# EAGLE schematic linkmp7 (EAGLE 5.05)
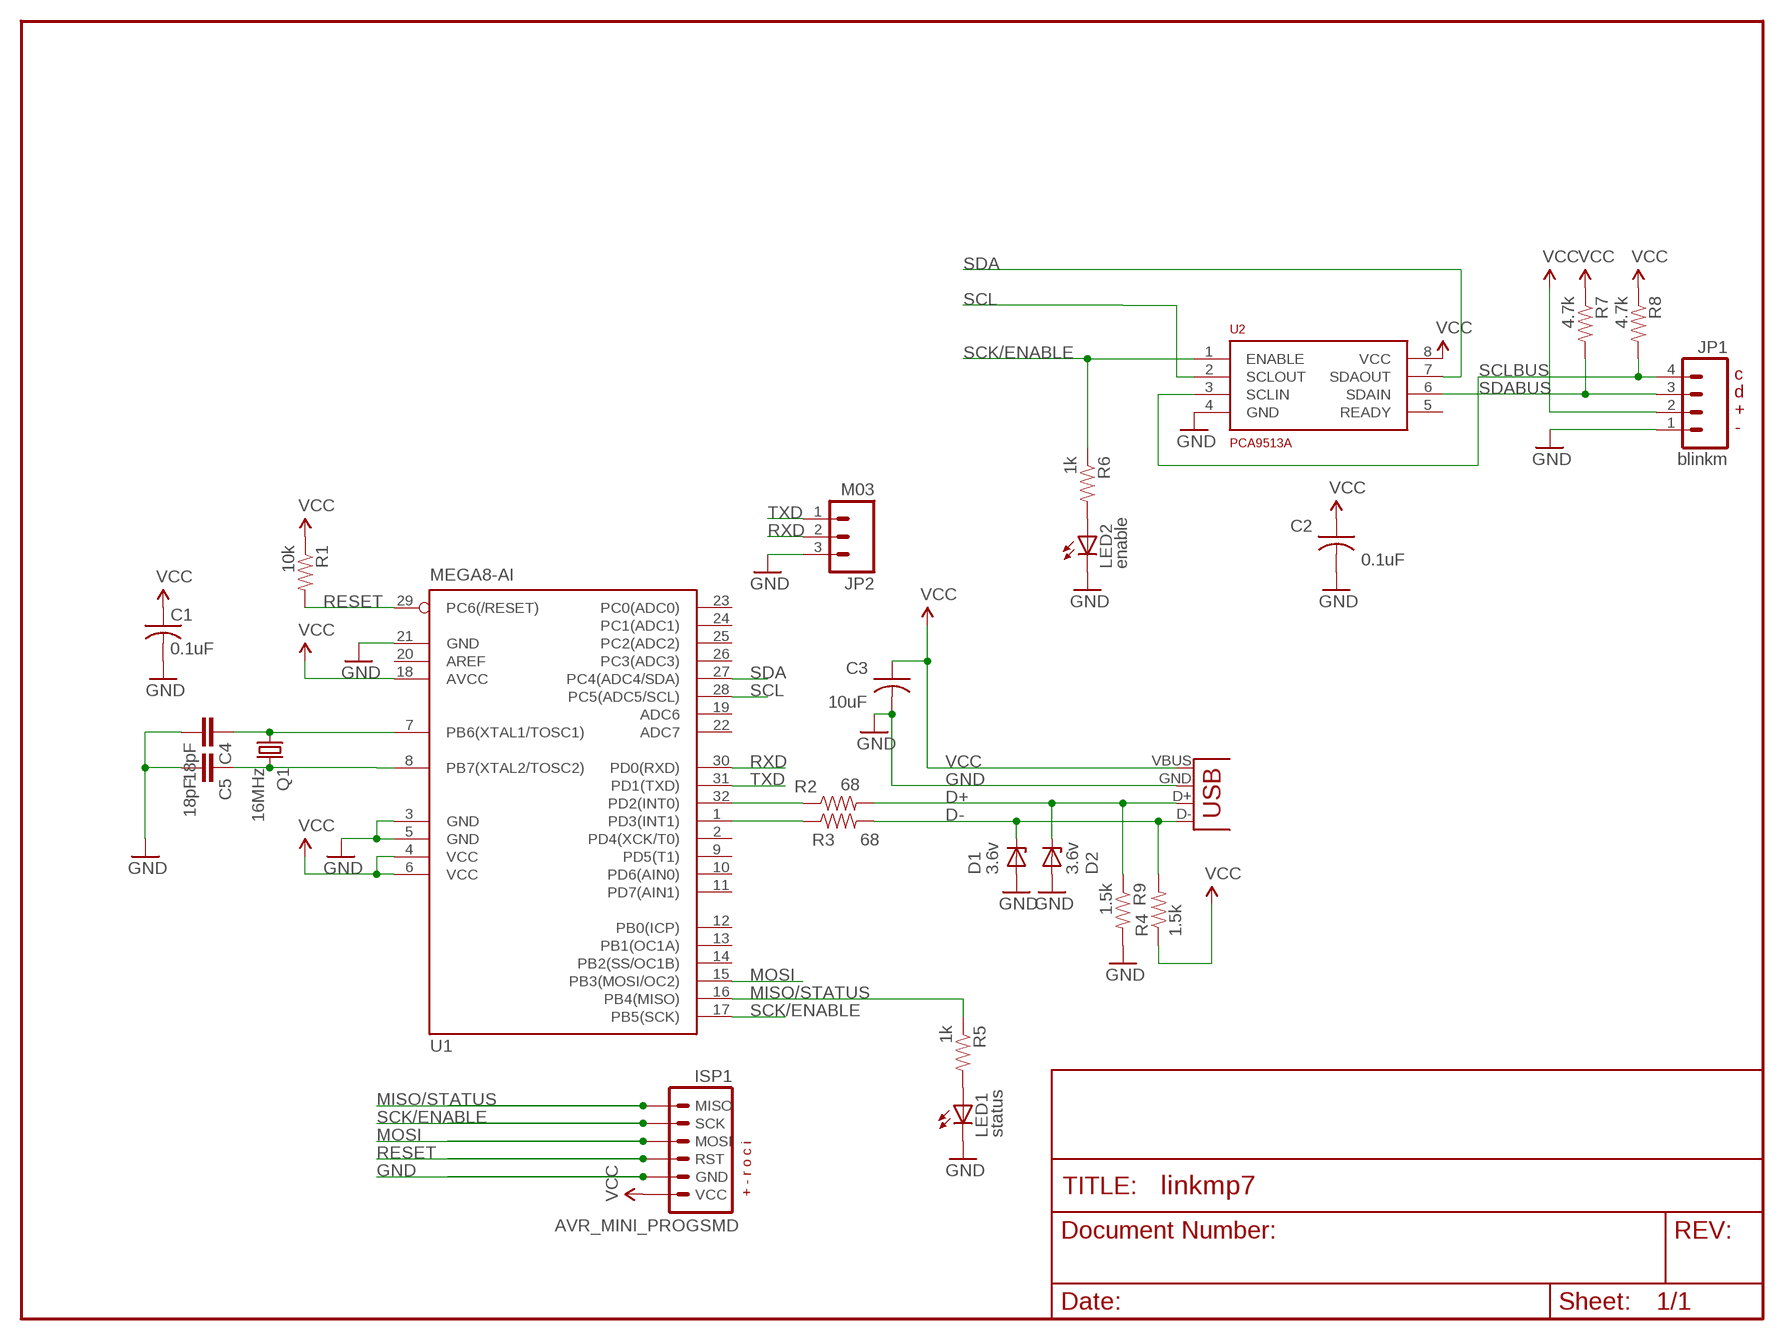
[diagram p0: schematic, sheet 1]

## Parts
C1  0.1uF  C-USC0603  [C0603]
C2  0.1uF  C-USC0603  [C0603]
C3  10uF  C-USC0805  [C0805]
C4  18pF  CAP0603  [0603]
C5  18pF  CAP0603  [0603]
D1  3.6v  ZENER-DIODESOT23  [SOT23]
D2  3.6v  ZENER-DIODESOT23  [SOT23]
ISP1  AVR_MINI_PROGSMD  [AVR_MINI_PROG]
JP1  blinkm  M04PTH  [1X04]
JP2  M03  [1X03-1.27MM]
LED1  status  LED0603  [LED-0603]
LED2  enable  LED0603  [LED-0603]
Q1  16MHz  CRYSTALHC49UV  [HC49U-V]
R1  10k  RESISTOR0603  [0603]
R2  68  RESISTOR0603  [0603]
R3  68  RESISTOR0603  [0603]
R4  1.5k  RESISTOR0603  [0603]
R5  1k  RESISTOR0603  [0603]
R6  1k  RESISTOR0603  [0603]
R7  4.7k  RESISTOR  [0805]
R8  4.7k  RESISTOR  [0805]
R9  1.5k  RESISTOR0603  [0603]
U1  MEGA8-AI  [TQFP32-08]
U2  PCA9513A  PCA9513AD  [SO08]
X1  USB-A-H  [USB-A-H]

## Nets
D+: D2.3(C) R2.2 R9.1 X1.D+(D-)
D-: D1.3(C) R3.2 R4.2 X1.D-(D+)
GND: C1.2 C2.2 C3.2 C4.2 C5.2 D1.1(A) D2.1(A) ISP1.2(GND) JP1.1 JP2.3 LED1.C LED2.C R9.2 U1.3(GND) U1.5(GND) U1.21(GND) U2.4(GND) X1.GND(VBUS)
MISO/STATUS: ISP1.6(MISO) R5.1 U1.16(PB4(MISO))
MOSI: ISP1.4(MOSI) U1.15(PB3(MOSI/OC2))
N$1: LED2.A R6.2
N$2: R2.1 U1.32(PD2(INT0))
N$6: C4.1 Q1.1 U1.7(PB6(XTAL1/TOSC1))
N$7: C5.1 Q1.2 U1.8(PB7(XTAL2/TOSC2))
N$8: LED1.A R5.2
N$9: R3.1 U1.1(PD3(INT1))
RESET: ISP1.3(RST) R1.2 U1.29(PC6(/RESET))
RXD: JP2.2 U1.30(PD0(RXD))
SCK/ENABLE: ISP1.5(SCK) R6.1 U1.17(PB5(SCK)) U2.1(ENABLE)
SCL: U1.28(PC5(ADC5/SCL)) U2.2(SCLOUT)
SCLBUS: JP1.4 R8.2 U2.3(SCLIN)
SDA: U1.27(PC4(ADC4/SDA)) U2.7(SDAOUT)
SDABUS: JP1.3 R7.2 U2.6(SDAIN)
TXD: JP2.1 U1.31(PD1(TXD))
VCC: C1.1 C2.1 C3.1 ISP1.1(VCC) JP1.2 R1.1 R4.1 R7.1 R8.1 U1.4(VCC) U1.6(VCC) U1.18(AVCC) U2.8(VCC) X1.VBUS(GND)
Unconnected: U1.2(PD4(XCK/T0)) U1.9(PD5(T1)) U1.10(PD6(AIN0)) U1.11(PD7(AIN1)) U1.12(PB0(ICP)) U1.13(PB1(OC1A)) U1.14(PB2(SS/OC1B)) U1.19(ADC6) U1.20(AREF) U1.22(ADC7) U1.23(PC0(ADC0)) U1.24(PC1(ADC1)) U1.25(PC2(ADC2)) U1.26(PC3(ADC3)) U2.5(READY)

## Notes on the sheet
- c
- d
- +
- -
- + - r o c i

## Library data of the parts
C1-C3 = rcl:C-US: CAPACITOR, American symbol
C4 C5 = SparkFun-20090330:CAP: Capacitor Standard 0603 ceramic capacitor, and 0.1" leaded capacitor.
D1 D2 = diode:ZENER-DIODE: Z-Diode
ISP1 = SparkFun-20090330:AVR_MINI_PROG
JP1 = SparkFun-20090330:M04: Header 4 Standard 4-pin 0.1" header. Use with straight break away headers (SKU : PRT-00116), right angle break away headers (PRT-00553), swiss pins (PRT-00743), machine pins (PRT-00117), and female headers (PRT-00115). Molex polarized connector foot print use with SKU : PRT-08231 with associated crimp pins and housings.
JP2 = todstuff:M03
LED1 LED2 = SparkFun-20090330:LED: LEDs Standard schematic elements and footprints for 5mm, 3mm, 1206, and 0603 sized LEDs. 5mm - Spark Fun Electronics SKU : COM-00529 (and others)
Q1 = SparkFun-20090330:CRYSTAL: Crystals Various standard crystals. Proven footprints. Spark Fun Electronics SKU : COM-00534
R1-R9 = SparkFun-20090330:RESISTOR: Resistor Basic schematic elements and footprints for 0603, 1206, and PTH 1/10th watt (small) resistors.
U1 = atmel:MEGA8: MICROCONTROLLER 8 Kbytes FLASH, 1 kbytes SRAM, 512 bytes EEPROM, USART, 6-channel 10 bit ADC, 2-channel 8 bit ADC Pin compatible with Atmega48, ATMega88, ATMega168 Source: avr.lbr
U2 = todstuff:PCA9513A: I2C hot-swappable buffer
X1 = SparkFun-20090330:USB: USB Connectors USB-B-PTH is fully proven SKU : PRT-00139 USB-miniB is fully proven SKU : PRT-00587 USB-A-PCB is untested. USB-A-H is throughly reviewed, but untested. Spark Fun Electronics SKU : PRT-00437 USB-B-SMT is throughly reviewed, but untested. Needs silkscreen touching up. USB-A-S has not been used/tested USB-MB-H has not been used/tested